# EAGLE schematic ATmega328P (EAGLE 9.5.2)
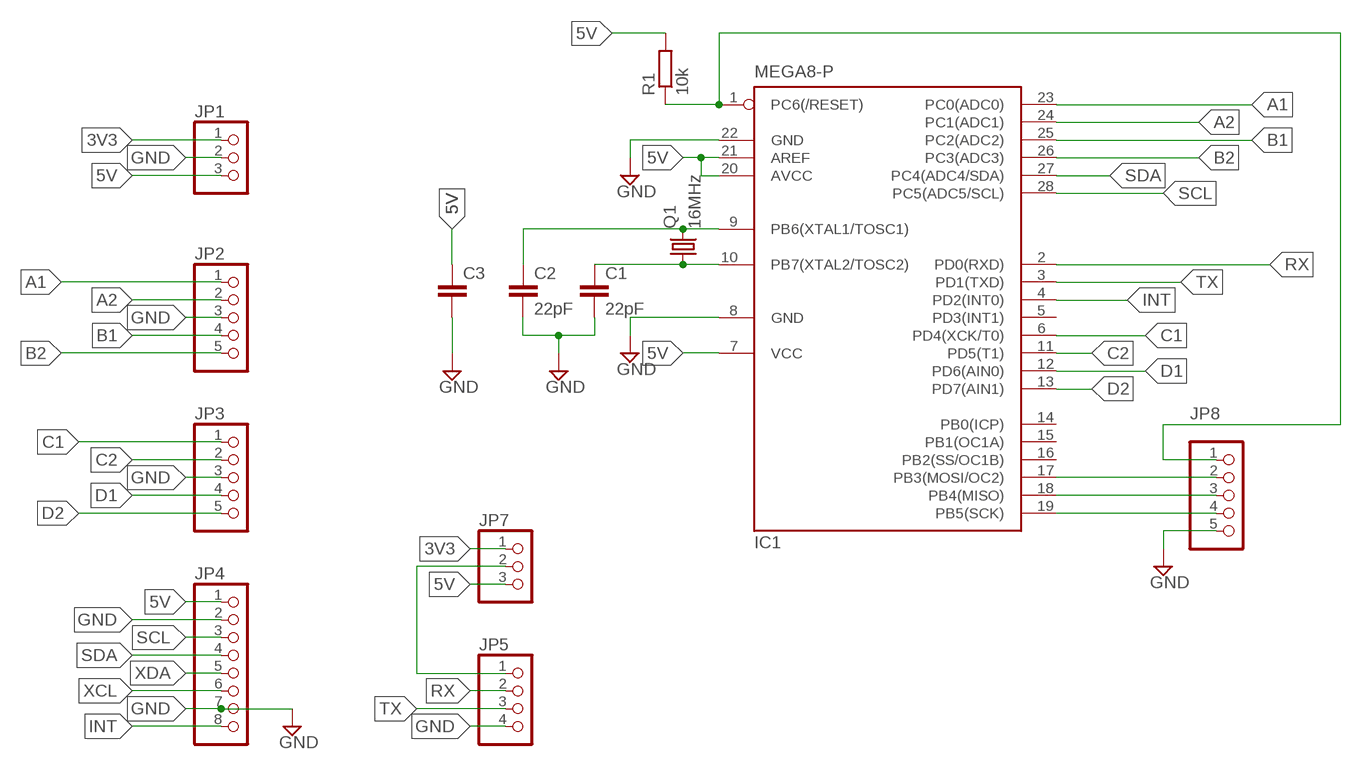
[diagram p0: schematic, sheet 1]

## Parts
C1  22pF  C2.5/2  [C2.5-2]
C2  22pF  C2.5/2  [C2.5-2]
C3  C2.5/2  [C2.5-2]
IC1  MEGA8-P  [DIL28-3]
JP1  PINHD-1X3/90  [1X03/90]
JP2  PINHD-1X5/90  [1X05/90]
JP3  PINHD-1X5/90  [1X05/90]
JP4  PINHD-1X8/90  [1X08/90]
JP5  PINHD-1X4/90  [1X04/90]
JP7  PINHD-1X3  [1X03]
JP8  PINHD-1X5  [1X05]
Q1  16MHz  CRYSTALHC49S  [HC49/S]
R1  10k  R-EU_0207/10  [0207/10]

## Nets
3V3: JP1.1 JP7.1
5V: C3.1 IC1.7(VCC) IC1.20(AVCC) IC1.21(AREF) JP1.3 JP4.1 JP7.3 R1.2
A1: IC1.23(PC0(ADC0)) JP2.1
A2: IC1.24(PC1(ADC1)) JP2.2
B1: IC1.25(PC2(ADC2)) JP2.4
B2: IC1.26(PC3(ADC3)) JP2.5
C1: IC1.6(PD4(XCK/T0)) JP3.1
C2: IC1.11(PD5(T1)) JP3.2
D1: IC1.12(PD6(AIN0)) JP3.4
D2: IC1.13(PD7(AIN1)) JP3.5
GND: C1.2 C2.2 C3.2 IC1.8(GND) IC1.22(GND) JP1.2 JP2.3 JP3.3 JP4.2 JP4.7 JP5.4 JP8.5
INT: IC1.4(PD2(INT0)) JP4.8
N$1: C2.1 IC1.9(PB6(XTAL1/TOSC1)) Q1.2
N$2: C1.1 IC1.10(PB7(XTAL2/TOSC2)) Q1.1
N$3: JP5.1 JP7.2
N$5: IC1.19(PB5(SCK)) JP8.4
N$6: IC1.18(PB4(MISO)) JP8.3
N$7: IC1.17(PB3(MOSI/OC2)) JP8.2
N$9: IC1.1(PC6(/RESET)) JP8.1 R1.1
RX: IC1.2(PD0(RXD)) JP5.2
SCL: IC1.28(PC5(ADC5/SCL)) JP4.3
SDA: IC1.27(PC4(ADC4/SDA)) JP4.4
TX: IC1.3(PD1(TXD)) JP5.3
XCL: JP4.6
XDA: JP4.5
Unconnected: IC1.5(PD3(INT1)) IC1.14(PB0(ICP)) IC1.15(PB1(OC1A)) IC1.16(PB2(SS/OC1B))

## Library data of the parts
C1-C3 = capacitor-wima:C: CAPACITOR naming: grid - package width
IC1 = atmel:MEGA8-P: MICROCONTROLLER 8 Kbytes FLASH, 1 kbytes SRAM, 512 bytes EEPROM, USART, 4-channel 10 bit ADC, 2-channel 8 bit ADC Pin compatible with Atmega48, ATMega88, ATMega168 Source: avr.lbr; OC_FARNELL: unknown; OC_NEWARK: unknown
JP1 JP7 = pinhead:PINHD-1X3: PIN HEADER
JP2 JP3 JP8 = pinhead:PINHD-1X5: PIN HEADER
JP4 = pinhead:PINHD-1X8: PIN HEADER
JP5 = pinhead:PINHD-1X4: PIN HEADER
Q1 = crystal:CRYSTAL: CRYSTAL; OC_FARNELL: 1667008; OC_NEWARK: unknown
R1 = rcl:R-EU_: RESISTOR, European symbol; SPICEPREFIX: R